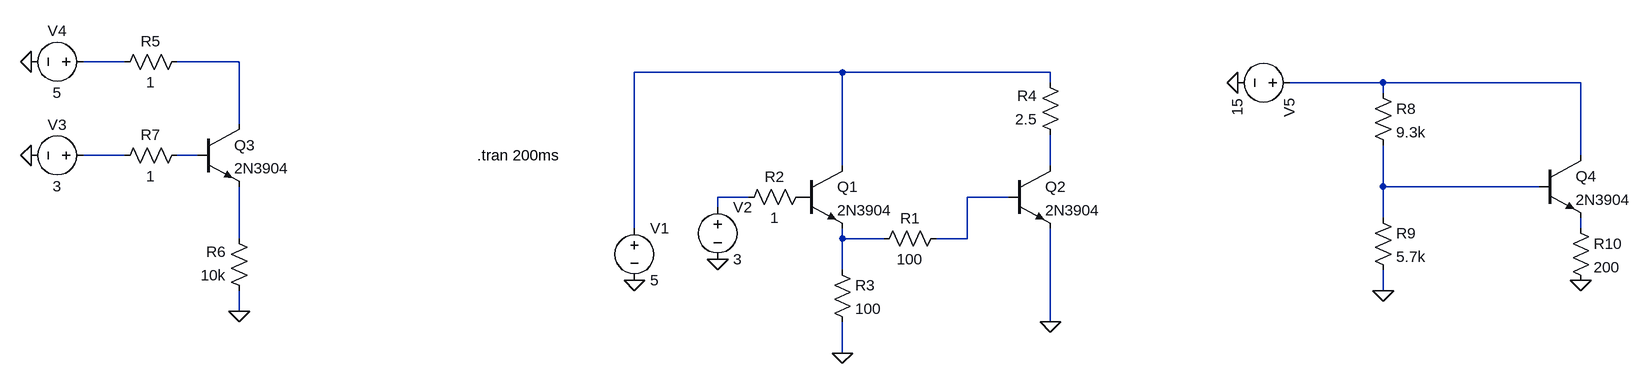
[diagram p0: schematic emitter_follower.asc]
emitter_follower.asc, the LTspice schematic file:
Version 4
SHEET 1 1464 680
WIRE -864 -32 -928 -32
WIRE -688 -32 -784 -32
WIRE 240 -16 -80 -16
WIRE 560 -16 240 -16
WIRE 560 0 560 -16
WIRE 1072 0 928 0
WIRE 1376 0 1072 0
WIRE 1072 16 1072 0
WIRE -688 64 -688 -32
WIRE -864 112 -928 112
WIRE -752 112 -784 112
WIRE 1376 112 1376 0
WIRE 240 128 240 -16
WIRE 560 128 560 80
WIRE 1072 160 1072 96
WIRE 1312 160 1072 160
WIRE 96 176 48 176
WIRE 496 176 432 176
WIRE 48 192 48 176
WIRE 1072 208 1072 160
WIRE -80 224 -80 -16
WIRE 1376 224 1376 208
WIRE -688 240 -688 160
WIRE 240 240 240 224
WIRE 304 240 240 240
WIRE 432 240 432 176
WIRE 432 240 384 240
WIRE 240 288 240 240
WIRE 1072 320 1072 288
WIRE -688 352 -688 320
WIRE 560 368 560 224
WIRE 240 416 240 368
FLAG 240 416 0
FLAG 560 368 0
FLAG -80 304 0
FLAG 48 272 0
FLAG -688 352 0
FLAG -1008 -32 0
FLAG -1008 112 0
FLAG 848 0 0
FLAG 1072 320 0
FLAG 1376 304 0
SYMBOL npn 176 128 R0
SYMATTR InstName Q1
SYMATTR Value 2N3904
SYMBOL npn 496 128 R0
SYMATTR InstName Q2
SYMATTR Value 2N3904
SYMBOL res 400 224 R90
WINDOW 0 0 56 VBottom 2
WINDOW 3 32 56 VTop 2
SYMATTR InstName R1
SYMATTR Value 100
SYMBOL res 576 96 R180
WINDOW 0 36 76 Left 2
WINDOW 3 36 40 Left 2
SYMATTR InstName R4
SYMATTR Value 2.5
SYMBOL voltage -80 208 R0
WINDOW 123 0 0 Left 0
WINDOW 39 0 0 Left 0
SYMATTR InstName V1
SYMATTR Value 5
SYMBOL voltage 48 176 R0
WINDOW 123 0 0 Left 0
WINDOW 39 0 0 Left 0
SYMATTR InstName V2
SYMATTR Value 3
SYMBOL res 192 160 R90
WINDOW 0 0 56 VBottom 2
WINDOW 3 32 56 VTop 2
SYMATTR InstName R2
SYMATTR Value 1
SYMBOL npn -752 64 R0
SYMATTR InstName Q3
SYMATTR Value 2N3904
SYMBOL res -672 336 R180
WINDOW 0 36 76 Left 2
WINDOW 3 36 40 Left 2
SYMATTR InstName R6
SYMATTR Value 10k
SYMBOL voltage -912 112 R90
WINDOW 0 -32 56 VBottom 2
WINDOW 3 32 56 VTop 2
WINDOW 123 0 0 Left 0
WINDOW 39 0 0 Left 0
SYMATTR InstName V3
SYMATTR Value 3
SYMBOL voltage -912 -32 R90
WINDOW 0 -32 56 VBottom 2
WINDOW 3 32 56 VTop 2
WINDOW 123 0 0 Left 0
WINDOW 39 0 0 Left 0
SYMATTR InstName V4
SYMATTR Value 5
SYMBOL res -880 -16 R270
WINDOW 0 32 56 VTop 2
WINDOW 3 0 56 VBottom 2
SYMATTR InstName R5
SYMATTR Value 1
SYMBOL res -880 128 R270
WINDOW 0 32 56 VTop 2
WINDOW 3 0 56 VBottom 2
SYMATTR InstName R7
SYMATTR Value 1
SYMBOL res 224 272 R0
SYMATTR InstName R3
SYMATTR Value 100
SYMBOL res 1056 0 R0
SYMATTR InstName R8
SYMATTR Value 9.3k
SYMBOL res 1056 192 R0
SYMATTR InstName R9
SYMATTR Value 5.7k
SYMBOL npn 1312 112 R0
SYMATTR InstName Q4
SYMATTR Value 2N3904
SYMBOL voltage 944 0 R90
WINDOW 123 0 0 Left 0
WINDOW 39 0 0 Left 0
SYMATTR InstName V5
SYMATTR Value 15
SYMBOL res 1360 208 R0
SYMATTR InstName R10
SYMATTR Value 200
TEXT -322 112 Left 2 !.tran 200ms

The netlist it stands for:
* emitter_follower.asc
Q1 N003 P001 N013 0 2N3904
Q2 N007 N010 0 0 2N3904
R1 N010 N013 100
R4 N007 N003 2.5
V1 N003 0 5
V2 N009 0 3
R2 P001 N009 1
Q3 N002 N006 N012 0 2N3904
R6 0 N012 10k
V3 N005 0 3
V4 N001 0 5
R5 N001 N002 1
R7 N005 N006 1
R3 N013 0 100
R8 N004 N008 9.3k
R9 N008 0 5.7k
Q4 N004 N008 N011 0 2N3904
V5 N004 0 15
R10 N011 0 200
.model NPN NPN
.model PNP PNP
.lib standard.bjt
.tran 200ms
.backanno
.end